# Altium schematic sheet LSU_Sheet1.SchDoc
size A3
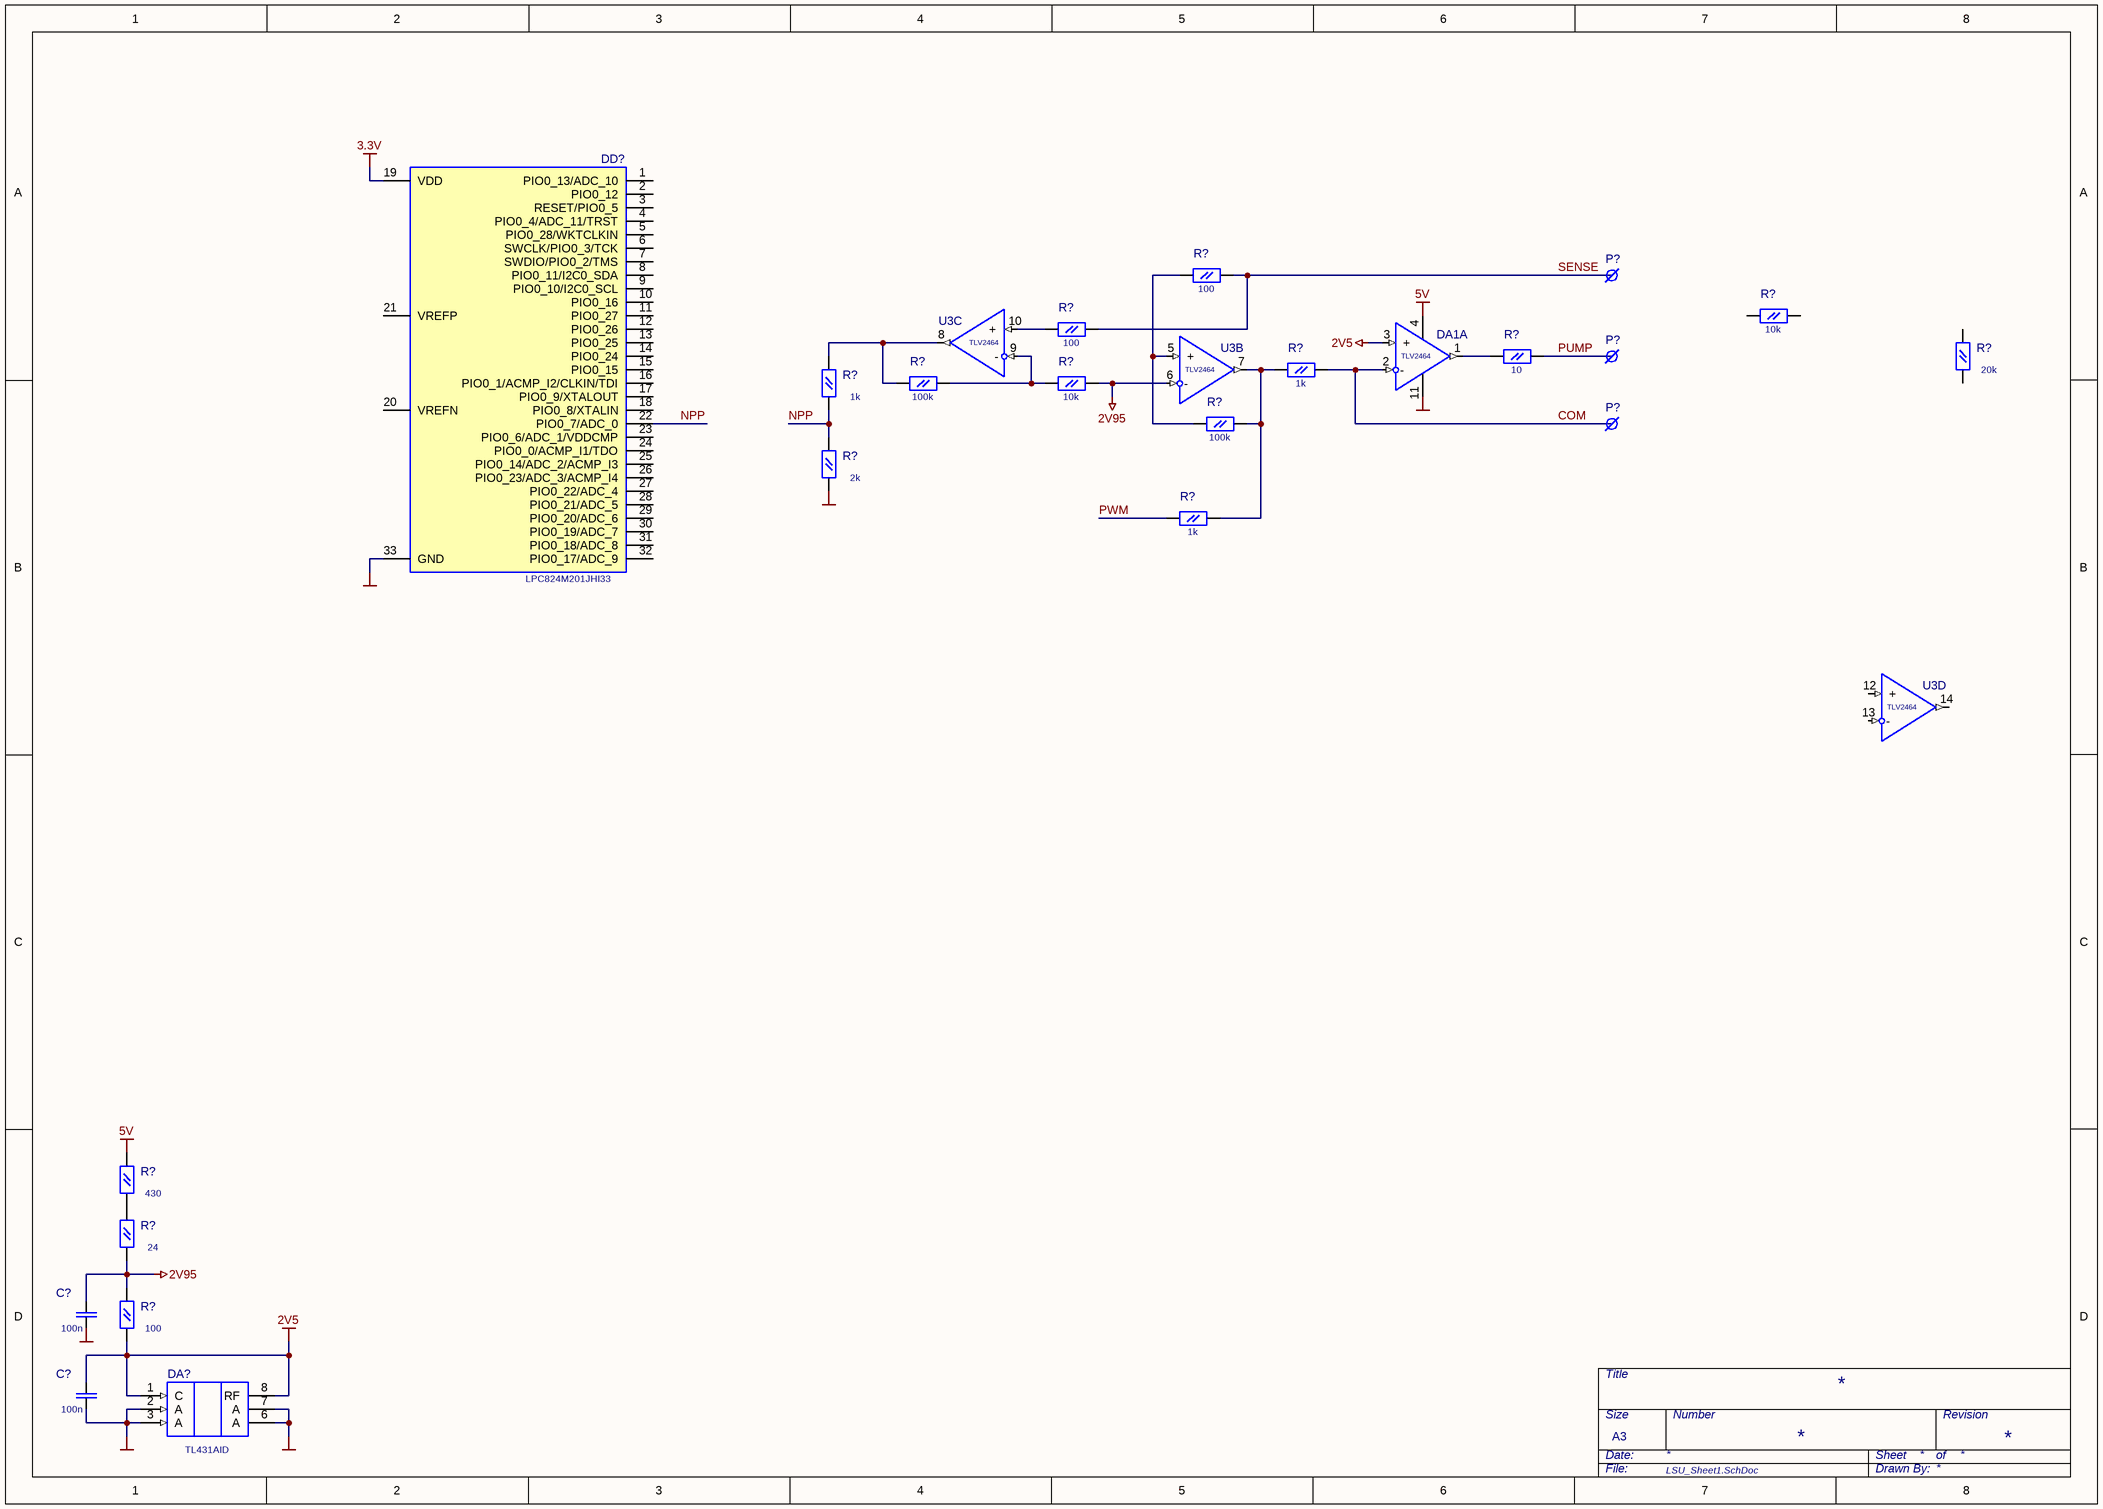
[diagram p0: LSU_Sheet1.SchDoc]

## Parts
(Parts that share a designator on the sheet are numbered #1, #2 ... from top to bottom, then left to right.)
C?#1  value 100n  [C0805]  (hidden comment: CSMD)
C?#2  value 100n  [C0805]  (hidden comment: CSMD)
DA1  TLV2464  [SOIC 14]  (part A of 4)
DA?  TL431AID  [SOIC8 JEDEC]
DD?  LPC824M201JHI33  [HVQFN33]
P?#1  X_P1/  [PIN]  (value not drawn)
P?#2  X_P1/  [PIN]  (value not drawn)
P?#3  X_P1/  [PIN]  (value not drawn)
R?#1  value 100  [R0805]  (hidden comment: RSMD)
R?#2  value 10k  [R0805]  (hidden comment: RSMD)
R?#3  value 100  [R0805]  (hidden comment: RSMD)
R?#4  value 10  [R0805]  (hidden comment: RSMD)
R?#5  value 1k  [R0805]  (hidden comment: RSMD)
R?#6  value 100k  [R0805]  (hidden comment: RSMD)
R?#7  value 10k  [R0805]  (hidden comment: RSMD)
R?#8  value 20k  [R0805]  (hidden comment: RSMD)
R?#9  value 1k  [R0805]  (hidden comment: RSMD)
R?#10  value 100k  [R0805]  (hidden comment: RSMD)
R?#11  value 2k  [R0805]  (hidden comment: RSMD)
R?#12  value 1k  [R0805]  (hidden comment: RSMD)
R?#13  value 430  [R0805]  (hidden comment: RSMD)
R?#14  value 24  [R0805]  (hidden comment: RSMD)
R?#15  value 100  [R0805]  (hidden comment: RSMD)
U3  TLV2464  [SOIC 14]  (parts B,C,D of 4)

## Nets
2V5: C?#2.2 DA1.3(+) DA?.1(C) DA?.8(RF) R?#15.1(Pin1)
2V95: C?#1.2 R?#7.2(Pin2) R?#14.1(Pin1) R?#15.2(Pin2) U3.6(-)
3.3V: DD?.19(VDD)
5V: DA1.4(V+) R?#13.2(Pin2)
GND: C?#1.1 C?#2.1 DA1.11(V-) DA?.2(A) DA?.3(A) DA?.6(A) DA?.7(A) DD?.33(GND) R?#11.1(Pin1)
COM: DA1.2(-) P?#3.1(1A) R?#5.2(Pin2)
NPP: DD?.22(PIO0_7/ADC_0) R?#9.1(Pin1) R?#11.2(Pin2)
PUMP: P?#2.1(1A) R?#4.2(Pin2)
PWM: R?#12.1(Pin1)
SENSE: P?#1.1(1A) R?#1.2(Pin2) R?#3.2(Pin2)
NetDA1_1: DA1.1(OUT) R?#4.1(Pin1)
NetR?#1_1: R?#1.1(Pin1) R?#10.1(Pin1) U3.5(+)
NetR?#3_1: R?#3.1(Pin1) U3.10(+)
NetR?#5_1: R?#5.1(Pin1) R?#10.2(Pin2) R?#12.2(Pin2) U3.7(OUT)
NetR?#6_1: R?#6.1(Pin1) R?#9.2(Pin2) U3.8(OUT)
NetR?#6_2: R?#6.2(Pin2) R?#7.1(Pin1) U3.9(-)
NetR?#13_1: R?#13.1(Pin1) R?#14.2(Pin2)

Not connected (* = marked no-connect by the designer): DD? 1(PIO0_13/ADC_10) 2(PIO0_12) 3(RESET/PIO0_5) 4(PIO0_4/ADC_11/TRST) 5(PIO0_28/WKTCLKIN) 6(SWCLK/PIO0_3/TCK) 7(SWDIO/PIO0_2/TMS) 8(PIO0_11/I2C0_SDA) 9(PIO0_10/I2C0_SCL) 10(PIO0_16) 11(PIO0_27) 12(PIO0_26) 13(PIO0_25) 14(PIO0_24) 15(PIO0_15) 16(PIO0_1/ACMP_I2/CLKIN/TDI) 17(PIO0_9/XTALOUT) 18(PIO0_8/XTALIN) 20(VREFN) 21(VREFP) 23(PIO0_6/ADC_1/VDDCMP) 24(PIO0_0/ACMP_I1/TDO) 25(PIO0_14/ADC_2/ACMP_I3) 26(PIO0_23/ADC_3/ACMP_I4) 27(PIO0_22/ADC_4) 28(PIO0_21/ADC_5) 29(PIO0_20/ADC_6) 30(PIO0_19/ADC_7) 31(PIO0_18/ADC_8) 32(PIO0_17/ADC_9); R?#2 1(Pin1) 2(Pin2); R?#8 1(Pin1) 2(Pin2); U3 12(+) 13(-) 14(OUT)

## Notes on the sheet
- Title
- Date:
- Size
- A3
- Number
- Sheet
- of
- Revision
- File:
- Drawn By:

## Library data of the parts
C?#1 C?#2 = CSMD: C0603; Voltage: *; Part Field 1: *; Part Field 2: *
DA1 U3 = AD824: Value: *
P?#1-P?#3 = X_P1/: Card-Edge Connector; Value: *
R?#1-R?#15 = RSMD: R0805; Part Field 1: *; Part Field 2: *